# Altium schematic sheet flight_controller.SchDoc
size A4
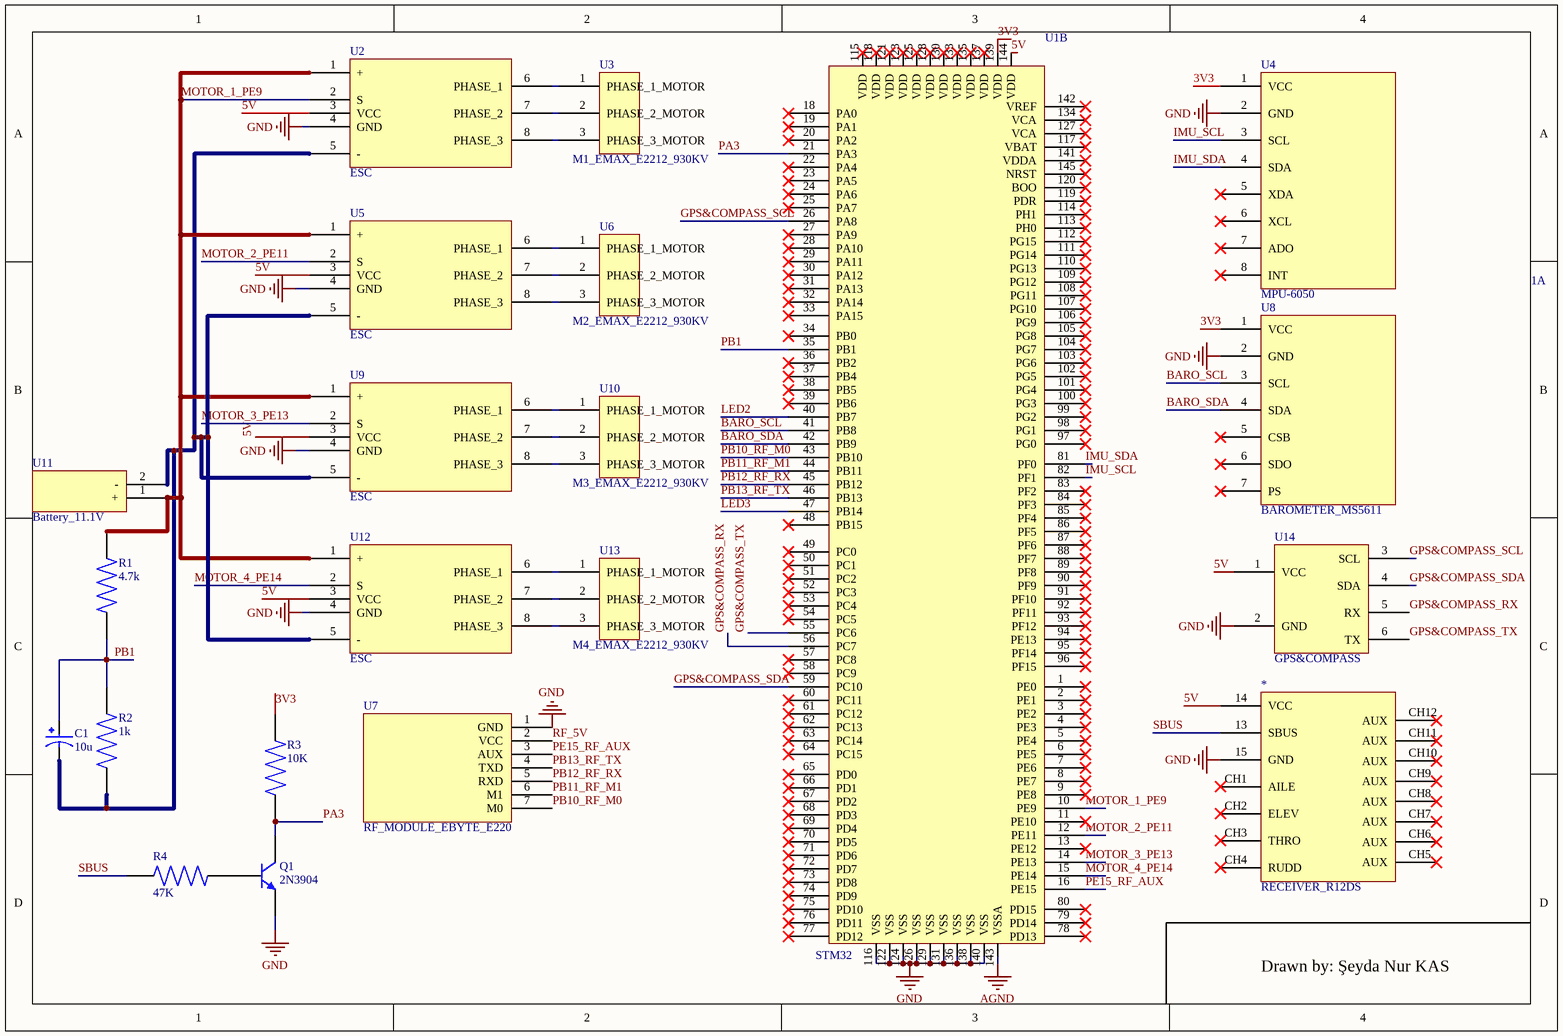
[diagram p0: flight_controller.SchDoc]

## Parts
1  (no value)  (part A of 2)
*  RECEIVER_R12DS
C1  10u  [CAP_EEEFN1J100L]
Q1  2N3904  [TO-92A]
R1  4.7k  [RES_ERJU1DJ472U]
R2  1k  [RESC2012X65N]
R3  10K  [RESC2012X65N]
R4  47K  [RESC2012X65N]
U1  STM32  (part B of 2)
U2  ESC
U3  M1_EMAX_E2212_930KV
U4  MPU-6050
U5  ESC
U6  M2_EMAX_E2212_930KV
U7  RF_MODULE_EBYTE_E220
U8  BAROMETER_MS5611
U9  ESC
U10  M3_EMAX_E2212_930KV
U11  Battery_11.1V
U12  ESC
U13  M4_EMAX_E2212_930KV
U14  GPS&COMPASS

## Nets
AGND: U1.143(VSSA)
GND: *.15(GND) Q1.1(E) U1.116(VSS) U1.122(VSS) U1.124(VSS) U1.126(VSS) U1.129(VSS) U1.131(VSS) U1.136(VSS) U1.138(VSS) U1.140(VSS) U2.4(GND) U4.2(GND) U5.4(GND) U7.1(GND) U8.2(GND) U9.4(GND) U12.4(GND) U14.2(GND)
3V3: R3.2 U1.139(VDD) U4.1(VCC) U8.1(VCC)
5V: *.14(VCC) U1.144(VDD) U2.3(VCC) U5.3(VCC) U9.3(VCC) U12.3(VCC) U14.1(VCC)
BARO_SCL: U1.41(PB8) U8.3(SCL)
BARO_SDA: U1.42(PB9) U8.4(SDA)
GPS&COMPASS_RX: U1.56(PC7) U14.5(RX)
GPS&COMPASS_SCL: U1.26(PA8) U14.3(SCL)
GPS&COMPASS_SDA: U1.59(PC10) U14.4(SDA)
GPS&COMPASS_TX: U1.55(PC6) U14.6(TX)
IMU_SCL: U1.82(PF1) U4.3(SCL)
IMU_SDA: U1.81(PF0) U4.4(SDA)
LED2: U1.40(PB7)
LED3: U1.47(PB14)
MOTOR_1_PE9: R1.2 U1.10(PE9) U2.1(+) U2.2(S) U5.1(+) U9.1(+) U11.1(+) U12.1(+)
MOTOR_2_PE11: U1.12(PE11) U5.2(S)
MOTOR_3_PE13: U1.14(PE13) U9.2(S)
MOTOR_4_PE14: U1.15(PE14) U12.2(S)
PA3: Q1.3(C) R3.1 U1.21(PA3)
PB1: C1.1 R1.1 R2.2 U1.35(PB1)
PB10_RF_M0: U1.43(PB10) U7.7(M0)
PB11_RF_M1: U1.44(PB11) U7.6(M1)
PB12_RF_RX: U1.45(PB12) U7.5(RXD)
PB13_RF_TX: U1.46(PB13) U7.4(TXD)
PE15_RF_AUX: U1.16(PE15) U7.3(AUX)
RF_5V: U7.2(VCC)
SBUS: *.13(SBUS) R4.1
NetC1_2: C1.2 R2.1 U2.5(-) U5.5(-) U9.5(-) U11.2(-) U12.5(-)
NetQ1_2: Q1.2(B) R4.2
NetU2_6: U2.6(PHASE_1) U3.1(PHASE_1_MOTOR)
NetU2_7: U2.7(PHASE_2) U3.2(PHASE_2_MOTOR)
NetU2_8: U2.8(PHASE_3) U3.3(PHASE_3_MOTOR)
NetU5_6: U5.6(PHASE_1) U6.1(PHASE_1_MOTOR)
NetU5_7: U5.7(PHASE_2) U6.2(PHASE_2_MOTOR)
NetU5_8: U5.8(PHASE_3) U6.3(PHASE_3_MOTOR)
NetU9_6: U9.6(PHASE_1) U10.1(PHASE_1_MOTOR)
NetU9_7: U9.7(PHASE_2) U10.2(PHASE_2_MOTOR)
NetU9_8: U9.8(PHASE_3) U10.3(PHASE_3_MOTOR)
NetU12_6: U12.6(PHASE_1) U13.1(PHASE_1_MOTOR)
NetU12_7: U12.7(PHASE_2) U13.2(PHASE_2_MOTOR)
NetU12_8: U12.8(PHASE_3) U13.3(PHASE_3_MOTOR)

Not connected (* = marked no-connect by the designer): * CH1(AILE)* CH2(ELEV)* CH3(THRO)* CH4(RUDD)* CH5(AUX)* CH6(AUX)* CH7(AUX)* CH8(AUX)* CH9(AUX)* CH10(AUX)* CH11(AUX)* CH12(AUX)*; U1 1(PE0)* 2(PE1)* 3(PE2)* 4(PE3)* 5(PE4)* 6(PE5)* 7(PE6)* 8(PE7)* 9(PE8)* 11(PE10)* 13(PE12)* 18(PA0)* 19(PA1)* 20(PA2)* 22(PA4)* 23(PA5)* 24(PA6)* 25(PA7)* 27(PA9)* 28(PA10)* 29(PA11)* 30(PA12)* 31(PA13)* 32(PA14)* 33(PA15)* 34(PB0)* 36(PB2)* 37(PB4)* 38(PB5)* 39(PB6)* 48(PB15)* 49(PC0)* 50(PC1)* 51(PC2)* 52(PC3)* 53(PC4)* 54(PC5)* 57(PC8)* 58(PC9)* 60(PC11)* 61(PC12)* 62(PC13)* 63(PC14)* 64(PC15)* 65(PD0)* 66(PD1)* 67(PD2)* 68(PD3)* 69(PD4)* 70(PD5)* 71(PD6)* 72(PD7)* 73(PD8)* 74(PD9)* 75(PD10)* 76(PD11)* 77(PD12)* 78(PD13)* 79(PD14)* 80(PD15)* 83(PF2)* 84(PF3)* 85(PF4)* 86(PF5)* 87(PF6)* 88(PF7)* 89(PF8)* 90(PF9)* 91(PF10)* 92(PF11)* 93(PF12)* 94(PE13)* 95(PF14)* 96(PF15)* 97(PG0)* 98(PG1)* 99(PG2)* 100(PG3)* 101(PG4)* 102(PG5)* 103(PG6)* 104(PG7)* 105(PG8)* 106(PG9)* 107(PG10)* 108(PG11)* 109(PG12)* 110(PG13)* 111(PG14)* 112(PG15)* 113(PH0)* 114(PH1)* 115(VDD)* 117(VBAT)* 118(VDD)* 119(PDR)* 120(BOO)* 121(VDD)* 123(VDD)* 125(VDD)* 127(VCA)* 128(VDD)* 130(VDD)* 133(VDD)* 134(VCA)* 135(VDD)* 137(VDD)* 141(VDDA)* 142(VREF)* 145(NRST)*; U4 5(XDA)* 6(XCL)* 7(ADO)* 8(INT)*; U8 5(CSB)* 6(SDO)* 7(PS)*

## Notes on the sheet
- Drawn by: Şeyda Nur KAS
- Title
- Size:
- Date:
- A4
- Number:
- Time:
- Revision:
- Sheet
- of
- File:

## Library data of the parts
1 * U1-U3 U5-U14 = Component_1
C1 = EEEFN1J100L: CAP ALUM 10UF 20% 63V SMD; MF: Panasonic Electronic Components; MP: EEE-FN1J100L; Availability: In Stock; Check_prices: https://www.snapeda.com/parts/EEE-FN1J100L/Panasonic/view-part/6178439/?ref=eda; Package: RADIAL-2 Panasonic; Price: None; SnapEDA_Link: https://www.snapeda.com/parts/EEE-FN1J100L/Panasonic/view-part/6178439/?ref=snap; Value: *
Q1 = 2N3904: NPN General Purpose Amplifier; Published: 8-Jun-2000; LatestRevisionDate: 15-Jan-2003; LatestRevisionNote: PCB Footprint 'BCY-W3/D4.7' replaced; DatasheetVersion: 1997; PackageVersion: Sep-1998; PackageReference: TO-92A; Publisher: Altium Limited; PackageDescription: TO, Flat Index; 3 In-Line, Axial Leads; Body Dia. 4.5mm; Leads 0.51 x 0.48 mm (max); ComponentLink1Description: Manufacturer Link; ComponentLink1URL: http://www.fairchildsemi.com/; ComponentLink2Description: Datasheet; ComponentLink2URL: http://www.fairchildsemi.com/ds/2N%2F2N3904.pdf
R1 = ERJU1DJ472U: Availability: Unavailable; Value: *; Price: None; Package: None; MP: ERJU1DJ472U
R2 = RN73C2A1K0BTG: RESISTOR, THIN FILM, 1K, 0.1%, 0805; MF: TE Connectivity; Availability: In Stock; EU_RoHS_Compliance: Compliant; SnapEDA_Link: https://www.snapeda.com/parts/RN73C2A1K0BTG/TE+Connectivity/view-part/?ref=snap; Price: None; Check_prices: https://www.snapeda.com/parts/RN73C2A1K0BTG/TE+Connectivity/view-part/?ref=eda; Package: 0805; MP: RN73C2A1K0BTG; Value: *; Purchase-URL: https://pricing.snapeda.com/search/part/RN73C2A1K0BTG/?ref=eda
R3 = CRGP0805F10K: Fixed Resistor CRGP 0805 10K 1%; MF: TE Connectivity; Price: None; Package: 2012 TE Connectivity; Value: *; MP: CRGP0805F10K; DigiKey-Purchase-URL: https://snapeda.com/shop?store=DigiKey&id=3187978; Availability: Unavailable; Mouser-Purchase-URL: https://snapeda.com/shop?store=Mouser&id=3187978; SnapEDA_Link: https://www.snapeda.com/parts/CRGP0805F10K/TE%20Connectivity/view-part/3187978/?ref=snap
R4 = CRGCQ0805J47K: Fixed Resistor CRGCQ 0805 47K 5%; MF: TE Connectivity; Package: 2012 TE Connectivity; Availability: Good; Value: *; MP: CRGCQ0805J47K; Purchase-URL: https://pricing.snapeda.com/search/part/CRGCQ0805J47K/?ref=eda; SnapEDA_Link: https://www.snapeda.com/parts/CRGCQ0805J47K/TE%20Connectivity/view-part/3187084/?ref=snap; Price: None